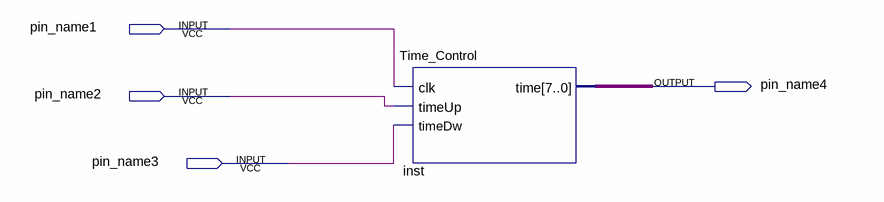
[diagram p0: schematic sheet]
// Quartus schematic Teste_Demo.bdf as structural Verilog: 1 symbols, 4 pins
module Teste_Demo (
  input  pin_name1,
  input  pin_name2,
  input  pin_name3,
  output pin_name4
);

  wire [7:0] inst_time;

  Time_Control inst (.clk(pin_name1), .timeUp(pin_name2), .timeDw(pin_name3), .\time (inst_time));
endmodule
